# EasyEDA schematic SCH_pie-day-pcb_2024-03-26.json
TITLE: Sheet_1; REV: 1.0; Date: 2024-03-05; Sheet: 1/1; Drawn By: revaga; Company: Your Company
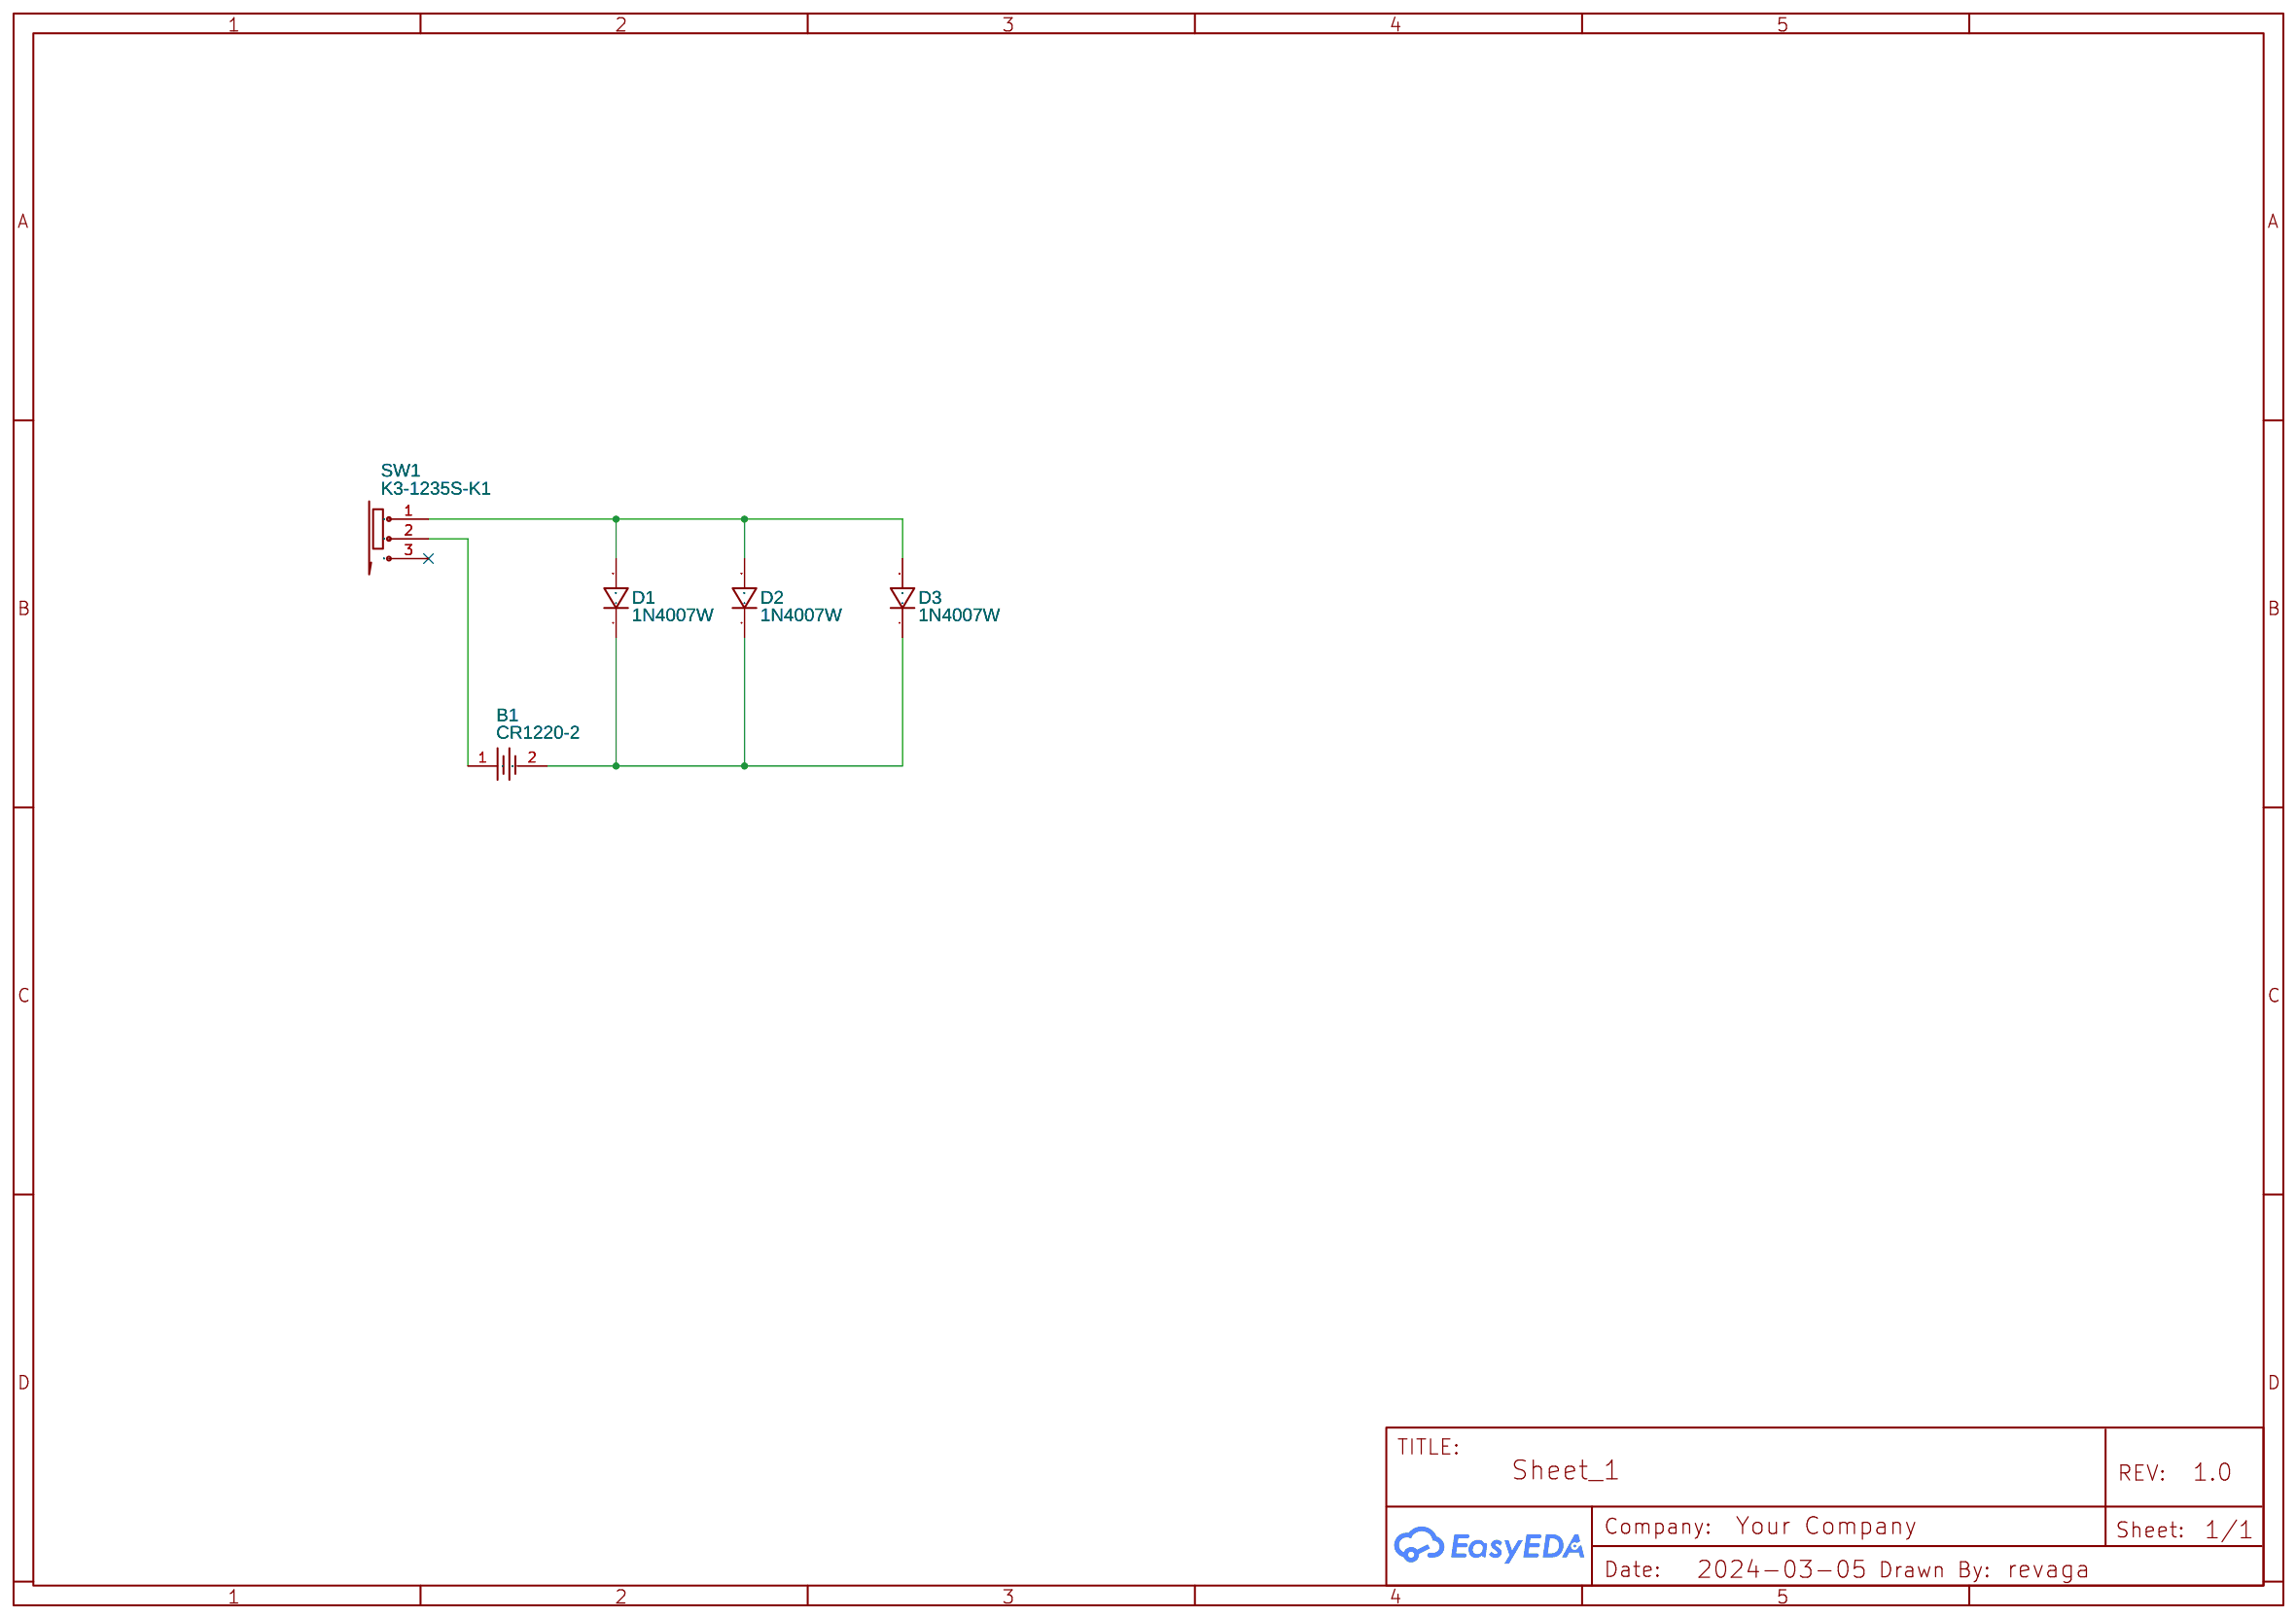
[diagram p0: schematic sheet]

## Parts
B1  CR1220-2  [BAT-SMD_CR1220-2]
D1  1N4007W  [SOD-123_L2.8-W1.8-LS3.7-RD]
D2  1N4007W  [SOD-123_L2.8-W1.8-LS3.7-RD]
D3  1N4007W  [SOD-123_L2.8-W1.8-LS3.7-RD]
SW1  K3-1235S-K1  [SW-SMD_K3-1235S-K1]

## Library data of the parts
B1 = CR1220-2: Supplier: LCSC; Manufacturer: Q&J; image: //image.lceda.cn/szlcsc/C70381.jpg; Supplier Part: C70381
D1-D3 = 1N4007W: Supplier: LCSC; Supplier Part: C328592; Manufacturer: BLUE ROCKET; Contributor: LCEDA_Lib
SW1 = K3-1235S-K1: Contributor: LCSC; Supplier: LCSC; Supplier Part: C223837; Manufacturer: 韩国韩荣; JLCPCB Part Class: Extended Part

## Nets
Net-(B1-1): B1.1 SW1.2
Net-(B1-2): B1.2 D1.1 D2.1 D3.1
Net-(D1-2): D1.2 D2.2 D3.2 SW1.1

Not connected (* = marked no-connect by the designer): SW1 3*
